# Altium project stm32f103c8t6最小系统板.PrjPcb
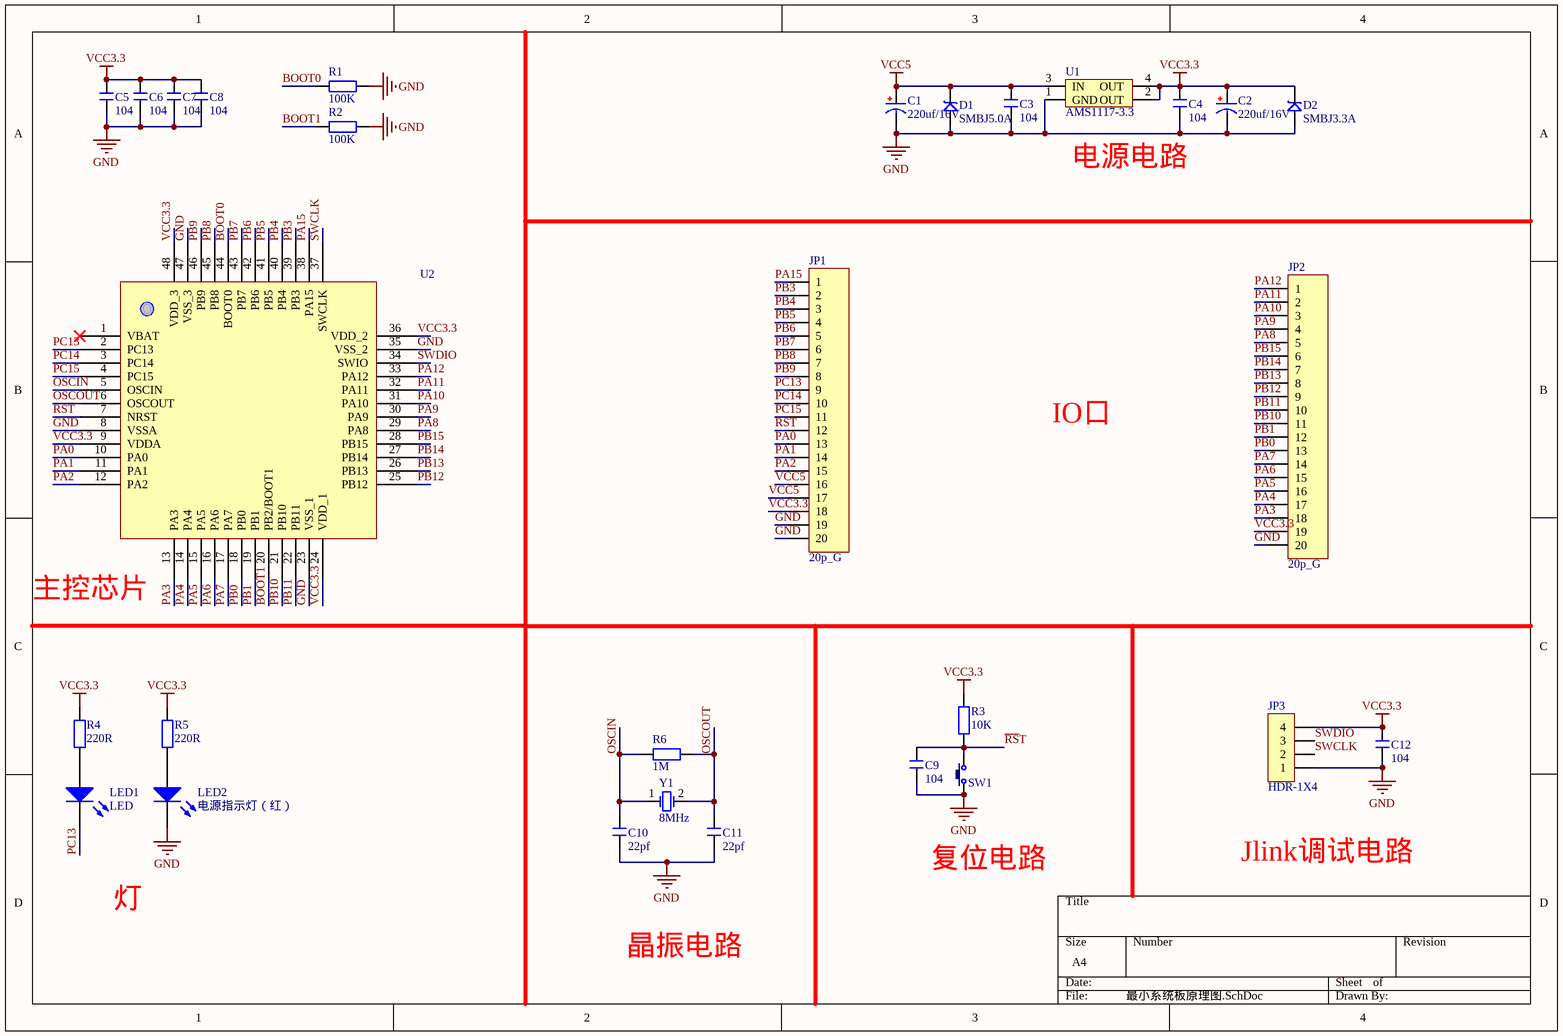
[diagram p0: 最小系统板原理图.SchDoc]
1 sheet, 29 parts. Net scope: global (net labels, ports and power ports of the same name join across sheets).
Board file: 最小系统板PCB.PcbDoc

## Sheet 最小系统板原理图.SchDoc
size A4; SheetNumber: 1; SheetTotal: 1

### Parts
C1  220uf/16V  [CM D(6.3)]
C2  220uf/16V  [CM D(6.3)]
C3  value 104  [0603C]  (hidden comment: 0603)
C4  value 104  [0603C]  (hidden comment: 0603)
C5  value 104  [0603C]  (hidden comment: 0603)
C6  value 104  [0603C]  (hidden comment: 0603)
C7  value 104  [0603C]  (hidden comment: 0603)
C8  value 104  [0603C]  (hidden comment: 0603)
C9  value 104  [0603C]  (hidden comment: 0603)
C10  value 22pf  [0603C]  (hidden comment: 0603)
C11  value 22pf  [0603C]  (hidden comment: 0603)
C12  value 104  [0603C]  (hidden comment: 0603)
D1  SMBJ5.0A  [SMB]
D2  SMBJ3.3A  [SMB]
JP1  20p_G  [HDR-1X20]
JP2  20p_G  [HDR-1X20]
JP3  HDR-1X4  [HDR-1X4]
LED1  LED  [LED 0603B]
LED2  电源指示灯（红）  [LED 0603R]
R1  value 100K  [0603R]  (hidden comment: 0603)
R2  value 100K  [0603R]  (hidden comment: 0603)
R3  value 10K  [0603R]  (hidden comment: 0603)
R4  value 220R  [0603R]  (hidden comment: 0603)
R5  value 220R  [0603R]  (hidden comment: 0603)
R6  value 1M  [0603R]  (hidden comment: 0603)
SW1  TSW  [TSW SMD-3*6*2.5]  (value not drawn)
U1  AMS1117-3.3  [SOT-223]
U2  STM32F103C8T6  [LQFP-48]  (value not drawn)
Y1  8MHz  [OSC HC-49S]

### Nets
GND: C1.2(GND) C2.2(GND) C3.1 C4.1 C5.1 C6.1 C7.1 C8.1 C9.1 C10.1 C11.1 C12.1 D1.1 D2.1 JP1.19 JP1.20 JP2.20 JP3.1 LED2.2(K) R1.1 R2.1 SW1.1 U1.1(GND) U2.8(VSSA) U2.23(VSS_1) U2.35(VSS_2) U2.47(VSS_3)
VCC3.3: C2.1(VCC) C4.2 C5.2 C6.2 C7.2 C8.2 C12.2 D2.2 JP1.18 JP2.19 JP3.4 R3.2 R4.1 R5.1 U1.2(OUT) U1.4(OUT) U2.9(VDDA) U2.24(VDD_1) U2.36(VDD_2) U2.48(VDD_3)
VCC5: C1.1(VCC) C3.2 D1.2 JP1.16 JP1.17 U1.3(IN)
BOOT0: R1.2 U2.44(BOOT0)
BOOT1: R2.2 U2.20(PB2/BOOT1)
OSCIN: C10.2 R6.1 U2.5(OSCIN) Y1.1(OSC1)
OSCOUT: C11.2 R6.2 U2.6(OSCOUT) Y1.2(OSC2)
PA0: JP1.13 U2.10(PA0)
PA1: JP1.14 U2.11(PA1)
PA2: JP1.15 U2.12(PA2)
PA3: JP2.18 U2.13(PA3)
PA4: JP2.17 U2.14(PA4)
PA5: JP2.16 U2.15(PA5)
PA6: JP2.15 U2.16(PA6)
PA7: JP2.14 U2.17(PA7)
PA8: JP2.5 U2.29(PA8)
PA9: JP2.4 U2.30(PA9)
PA10: JP2.3 U2.31(PA10)
PA11: JP2.2 U2.32(PA11)
PA12: JP2.1 U2.33(PA12)
PA15: JP1.1 U2.38(PA15)
PB0: JP2.13 U2.18(PB0)
PB1: JP2.12 U2.19(PB1)
PB3: JP1.2 U2.39(PB3)
PB4: JP1.3 U2.40(PB4)
PB5: JP1.4 U2.41(PB5)
PB6: JP1.5 U2.42(PB6)
PB7: JP1.6 U2.43(PB7)
PB8: JP1.7 U2.45(PB8)
PB9: JP1.8 U2.46(PB9)
PB10: JP2.11 U2.21(PB10)
PB11: JP2.10 U2.22(PB11)
PB12: JP2.9 U2.25(PB12)
PB13: JP2.8 U2.26(PB13)
PB14: JP2.7 U2.27(PB14)
PB15: JP2.6 U2.28(PB15)
PC13: JP1.9 LED1.2(K) U2.2(PC13)
PC14: JP1.10 U2.3(PC14)
PC15: JP1.11 U2.4(PC15)
~{RS}T: C9.2 JP1.12 R3.1 SW1.2 U2.7(NRST)
SWCLK: JP3.2 U2.37(SWCLK)
SWDIO: JP3.3 U2.34(SWIO)
NetLED1_1: LED1.1(A) R4.2
NetLED2_1: LED2.1(A) R5.2

Not connected (* = marked no-connect by the designer): U2 1(VBAT)*

### Notes on the sheet
- 电源电路
- IO口
- (near U2) 主控芯片
- 灯
- 复位电路
- Jlink调试电路
- 晶振电路

### Library data of the parts
C1 C2 = CAP: 极性电容
C3-C12 = C: 贴片电容
D1 D2 = SMBJ: TVS二极管
JP1 JP2 = 20p_G: 20针排针
JP3 = 4p_G: 4针排针; BOM名称: 4P接插件; 版权归属: 源创客; 学习资源: www.ooocke.com
LED1 LED2 = LED: RED 蓝、红; Published: 8-Jun-2000; LatestRevisionDate: 17-Jul-2002; LatestRevisionNote: Re-released for DXP Platform.; PackageDocument: Feb-2002; PackageReference: 3.2X1.6X1.1; Publisher: Altium Limited
R1-R6 = R: 贴片电阻
SW1 = TSW: 轻触开关; BOM名称: 3x6轻触开关; 版权归属: 源创客; 学习资源: www.ooocke.com
U1 = AMS1117: LDO5-3.3稳压芯片
U2 = STM32F103C8T6: MCU
Y1 = XTAL: 晶振; Published: 8-Jun-2000; LatestRevisionDate: 17-Jul-2002; LatestRevisionNote: Re-released for DXP Platform.; Publisher: Altium Limited